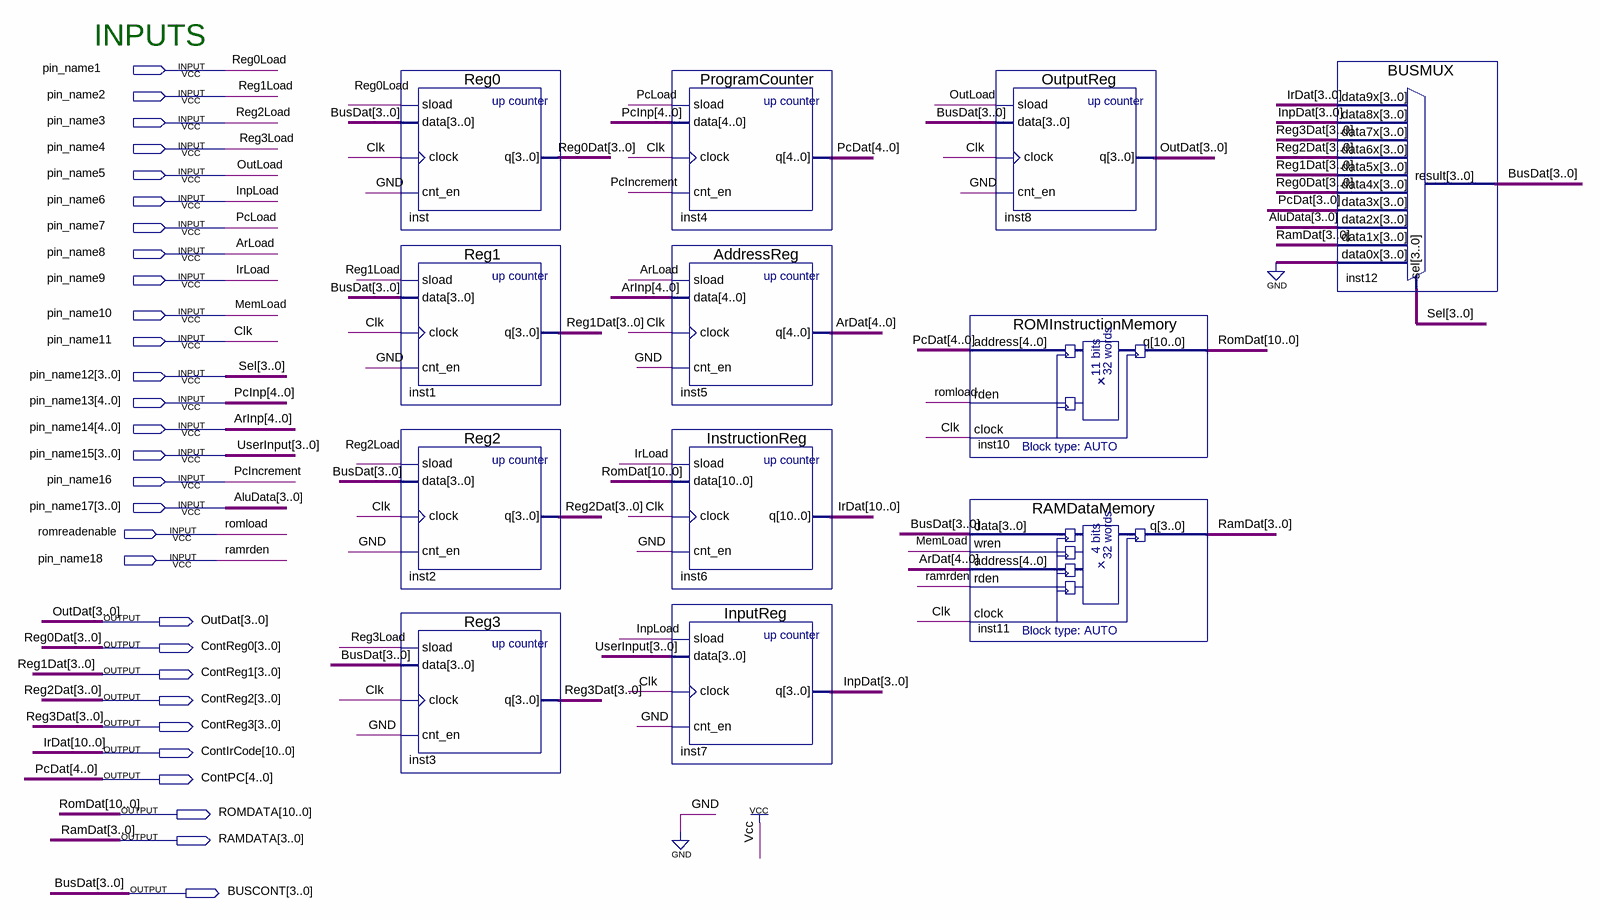
[diagram p0: schematic sheet]
// Quartus schematic Block1.bdf as structural Verilog: 12 symbols, 29 pins
module Block1 (
  input  pin_name1,
  input  pin_name2,
  input  pin_name3,
  input  pin_name4,
  input  pin_name5,
  input  pin_name6,
  input  pin_name7,
  input  pin_name8,
  input  pin_name9,
  input  pin_name10,
  input  pin_name11,
  input  [3:0] pin_name12,
  input  [4:0] pin_name13,
  input  [4:0] pin_name14,
  input  [3:0] pin_name15,
  input  pin_name16,
  input  [3:0] pin_name17,
  input  romreadenable,
  input  pin_name18,
  output [3:0] OutDat,
  output [3:0] ContReg0,
  output [3:0] ContReg1,
  output [3:0] ContReg2,
  output [3:0] ContReg3,
  output [10:0] ContIrCode,
  output [4:0] ContPC,
  output [10:0] ROMDATA,
  output [3:0] RAMDATA,
  output [3:0] BUSCONT
);

  wire [3:0] InpDat;
  wire [4:0] ArDat;

  Reg0 inst (.sload(pin_name1), .data(BUSCONT), .clock(pin_name11), .cnt_en(1'b0), .q(ContReg0));
  Reg1 inst1 (.sload(pin_name2), .data(BUSCONT), .clock(pin_name11), .cnt_en(1'b0), .q(ContReg1));
  Reg2 inst2 (.sload(pin_name3), .data(BUSCONT), .clock(pin_name11), .cnt_en(1'b0), .q(ContReg2));
  Reg3 inst3 (.sload(pin_name4), .data(BUSCONT), .clock(pin_name11), .cnt_en(1'b0), .q(ContReg3));
  ProgramCounter inst4 (.sload(pin_name7), .data(pin_name13), .clock(pin_name11), .cnt_en(pin_name16), .q(ContPC));
  AddressReg inst5 (.sload(pin_name8), .data(pin_name14), .clock(pin_name11), .cnt_en(1'b0), .q(ArDat));
  InstructionReg inst6 (.sload(pin_name9), .data(ROMDATA), .clock(pin_name11), .cnt_en(1'b0), .q(ContIrCode));
  InputReg inst7 (.sload(pin_name6), .data(pin_name15), .clock(pin_name11), .cnt_en(1'b0), .q(InpDat));
  OutputReg inst8 (.sload(pin_name5), .data(BUSCONT), .clock(pin_name11), .cnt_en(1'b0), .q(OutDat));
  ROMInstructionMemory inst10 (.address(ContPC), .rden(romreadenable), .clock(pin_name11), .q(ROMDATA));
  RAMDataMemory inst11 (
    .data(BUSCONT), .wren(pin_name10), .address(ArDat), .rden(pin_name18), .clock(pin_name11), .q(RAMDATA));
  BUSMUX inst12 (
    .data9x(ContIrCode[3:0]), .data8x(InpDat), .data7x(ContReg3), .data6x(ContReg2), .data5x(ContReg1),
    .data4x(ContReg0), .data3x(ContPC[3:0]), .data2x(pin_name17), .data1x(RAMDATA), .data0x(4'b0000),
    .sel(pin_name12), .result(BUSCONT));

  // Other names for the same wires on the sheet: AluData[3:0] = pin_name17; ArInp[4:0] = pin_name14;
  //   ArLoad = pin_name8; BusDat[3:0] = BUSCONT; Clk = pin_name11; InpLoad = pin_name6; IrDat[10:0] = ContIrCode;
  //   IrLoad = pin_name9; MemLoad = pin_name10; OutLoad = pin_name5; PcDat[4:0] = ContPC; PcIncrement = pin_name16;
  //   PcInp[4:0] = pin_name13; PcLoad = pin_name7; RamDat[3:0] = RAMDATA; ramrden = pin_name18;
  //   Reg0Dat[3:0] = ContReg0; Reg0Load = pin_name1; Reg1Dat[3:0] = ContReg1; Reg1Load = pin_name2;
  //   Reg2Dat[3:0] = ContReg2; Reg2Load = pin_name3; Reg3Dat[3:0] = ContReg3; Reg3Load = pin_name4;
  //   RomDat[10:0] = ROMDATA; romload = romreadenable; Sel[3:0] = pin_name12; UserInput[3:0] = pin_name15

  // Notes on the sheet:
  //   INPUTS
endmodule
